# Altium schematic sheet PCB_DYBoard_Collector_V1_Sh1.SchDoc
size A4; SheetNumber: 1; SheetTotal: 3
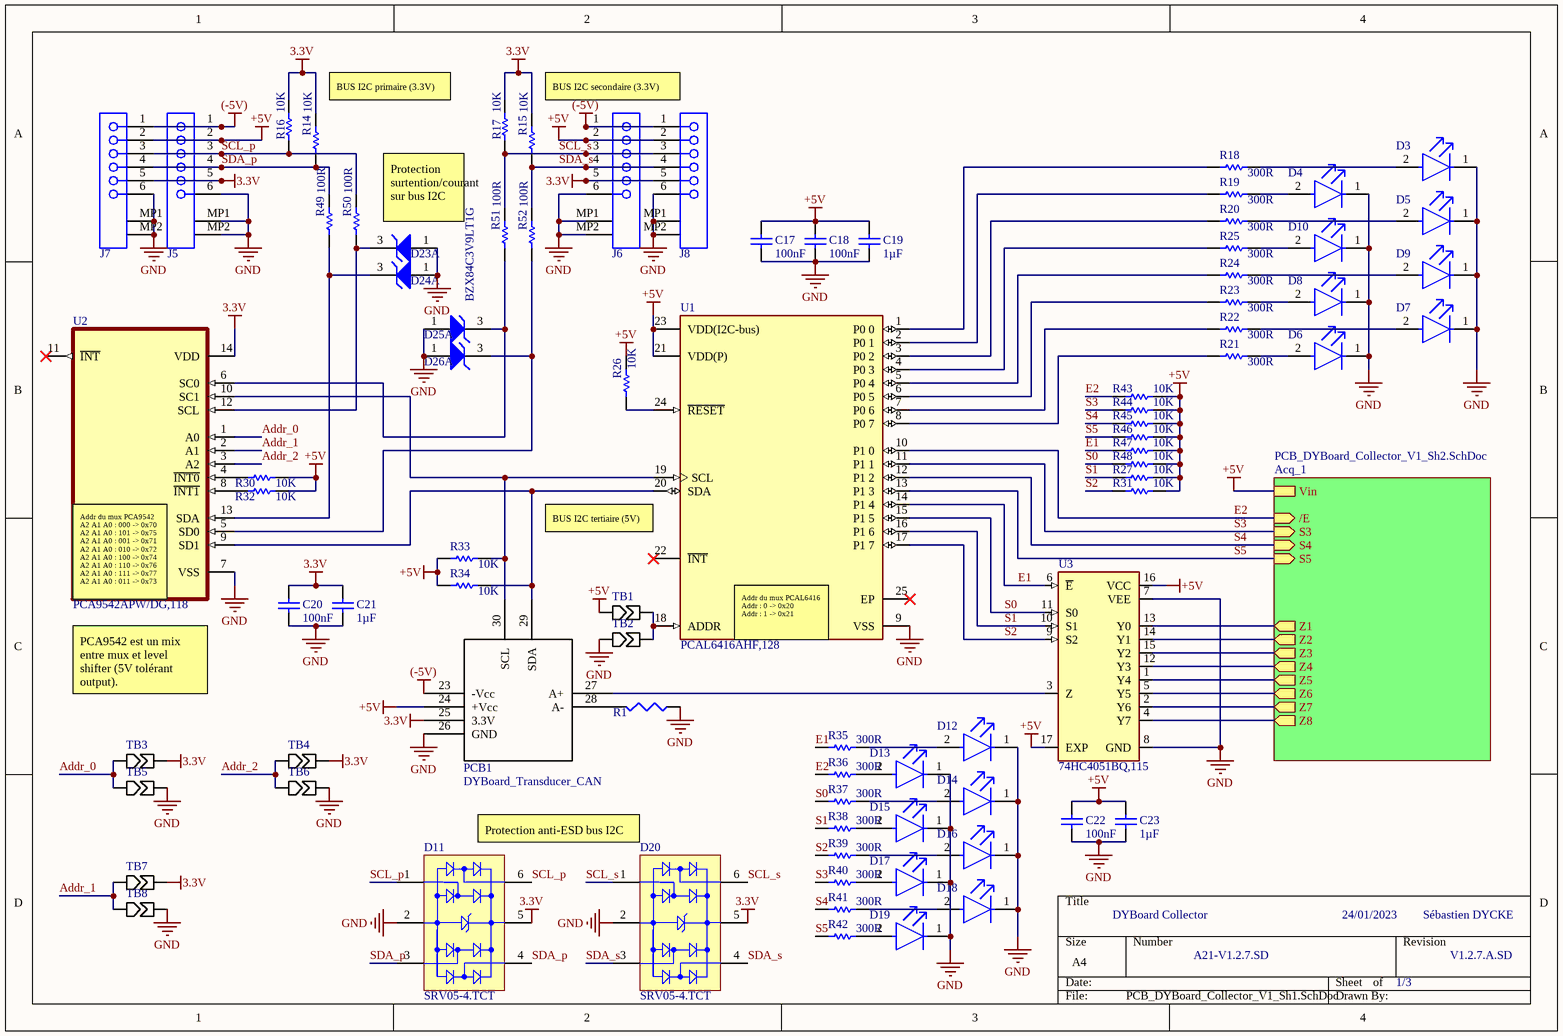
[diagram p0: PCB_DYBoard_Collector_V1_Sh1.SchDoc]

## Parts
C17  value 100nF  [1608[0603]]  (hidden comment: Cap Semi)
C18  value 100nF  [1608[0603]]  (hidden comment: Cap Semi)
C19  value 1µF  [1608[0603]]  (hidden comment: Cap Semi)
C20  value 100nF  [1608[0603]]  (hidden comment: Cap Semi)
C21  value 1µF  [1608[0603]]  (hidden comment: Cap Semi)
C22  value 100nF  [1608[0603]]  (hidden comment: Cap Semi)
C23  value 1µF  [1608[0603]]  (hidden comment: Cap Semi)
D3  LTST-C191TBKT  [FP-LTST-C191TBKT-MFG]  (value not drawn)
D4  LTST-C191TBKT  [FP-LTST-C191TBKT-MFG]  (value not drawn)
D5  LTST-C191TBKT  [FP-LTST-C191TBKT-MFG]  (value not drawn)
D6  LTST-C191TBKT  [FP-LTST-C191TBKT-MFG]  (value not drawn)
D7  LTST-C191TBKT  [FP-LTST-C191TBKT-MFG]  (value not drawn)
D8  LTST-C191TBKT  [FP-LTST-C191TBKT-MFG]  (value not drawn)
D9  LTST-C191TBKT  [FP-LTST-C191TBKT-MFG]  (value not drawn)
D10  LTST-C191TBKT  [FP-LTST-C191TBKT-MFG]  (value not drawn)
D11  SRV05-4.TCT  [SMTC-SOT23-6_V]
D12  LTST-C191TBKT  [FP-LTST-C191TBKT-MFG]  (value not drawn)
D13  LTST-C191TBKT  [FP-LTST-C191TBKT-MFG]  (value not drawn)
D14  LTST-C191TBKT  [FP-LTST-C191TBKT-MFG]  (value not drawn)
D15  LTST-C191TBKT  [FP-LTST-C191TBKT-MFG]  (value not drawn)
D16  LTST-C191TBKT  [FP-LTST-C191TBKT-MFG]  (value not drawn)
D17  LTST-C191TBKT  [FP-LTST-C191TBKT-MFG]  (value not drawn)
D18  LTST-C191TBKT  [FP-LTST-C191TBKT-MFG]  (value not drawn)
D19  LTST-C191TBKT  [FP-LTST-C191TBKT-MFG]  (value not drawn)
D20  SRV05-4.TCT  [SMTC-SOT23-6_V]
D23  BZX84C3V9LT1G  [ONSC-SOT-23-3-318-08_V]  (part A of 2)
D24  BZX84C3V9LT1G  [ONSC-SOT-23-3-318-08_V]  (value not drawn)  (part A of 2)
D25  BZX84C3V9LT1G  [ONSC-SOT-23-3-318-08_V]  (value not drawn)  (part A of 2)
D26  BZX84C3V9LT1G  [ONSC-SOT-23-3-318-08_V]  (value not drawn)  (part A of 2)
J5  SEB_MOLeX_6p  [SEB_MOLeX_6p]  (value not drawn)
J6  SEB_MOLeX_6p  [SEB_MOLeX_6p]  (value not drawn)
J7  SEB_MOLeX_6p  [SEB_MOLeX_6p]  (value not drawn)
J8  SEB_MOLeX_6p  [SEB_MOLeX_6p]  (value not drawn)
PCB1  DYBoard_Transducer_CAN  [DYBoard_Transducer_CAN]
R1  Res3  [J1-0603]  (value not drawn)
R14  10K  [RESC1609X60X30LL10T20]
R15  10K  [RESC1609X60X30LL10T20]
R16  10K  [RESC1609X60X30LL10T20]
R17  10K  [RESC1609X60X30LL10T20]
R18  300R  [RESC1609X60X30LL10T20]
R19  300R  [RESC1609X60X30LL10T20]
R20  300R  [RESC1609X60X30LL10T20]
R21  300R  [RESC1609X60X30LL10T20]
R22  300R  [RESC1609X60X30LL10T20]
R23  300R  [RESC1609X60X30LL10T20]
R24  300R  [RESC1609X60X30LL10T20]
R25  300R  [RESC1609X60X30LL10T20]
R26  10K  [RESC1609X60X30LL10T20]
R27  10K  [RESC1609X60X30LL10T20]
R30  10K  [RESC1609X60X30LL10T20]
R31  10K  [RESC1609X60X30LL10T20]
R32  10K  [RESC1609X60X30LL10T20]
R33  10K  [RESC1609X60X30LL10T20]
R34  10K  [RESC1609X60X30LL10T20]
R35  300R  [RESC1609X60X30LL10T20]
R36  300R  [RESC1609X60X30LL10T20]
R37  300R  [RESC1609X60X30LL10T20]
R38  300R  [RESC1609X60X30LL10T20]
R39  300R  [RESC1609X60X30LL10T20]
R40  300R  [RESC1609X60X30LL10T20]
R41  300R  [RESC1609X60X30LL10T20]
R42  300R  [RESC1609X60X30LL10T20]
R43  10K  [RESC1609X60X30LL10T20]
R44  10K  [RESC1609X60X30LL10T20]
R45  10K  [RESC1609X60X30LL10T20]
R46  10K  [RESC1609X60X30LL10T20]
R47  10K  [RESC1609X60X30LL10T20]
R48  10K  [RESC1609X60X30LL10T20]
R49  100R  [RESC1609X60X30LL10T20]
R50  100R  [RESC1609X60X30LL10T20]
R51  100R  [RESC1609X60X30LL10T20]
R52  100R  [RESC1609X60X30LL10T20]
TB1  tin_bridge  [tin_bridge]  (value not drawn)
TB2  tin_bridge  [tin_bridge]  (value not drawn)
TB3  tin_bridge  [tin_bridge]  (value not drawn)
TB4  tin_bridge  [tin_bridge]  (value not drawn)
TB5  tin_bridge  [tin_bridge]  (value not drawn)
TB6  tin_bridge  [tin_bridge]  (value not drawn)
TB7  tin_bridge  [tin_bridge]  (value not drawn)
TB8  tin_bridge  [tin_bridge]  (value not drawn)
U1  PCAL6416AHF,128  [FP-SOT994-1-MFG]
U2  PCA9542APW/DG,118  [SOP65P640X110-14N]
U3  74HC4051BQ,115  [QFN50P250X350X100-17N]

## Sub-sheets
Acq_1 = PCB_DYBoard_Collector_V1_Sh2.SchDoc: Vin, Z1 (out), S3 (in), S4 (in), S5 (in), /E (in), Z2 (out), Z3 (out), Z4 (out), Z5 (out), Z6 (out), Z7 (out), Z8 (out)

## Nets
3.3V: C20.2 C21.2 D11.5(VBUS) D20.5(VBUS) J5.5 J6.5 J7.5 J8.5 PCB1.25(3.3V) R14.2 R15.2 R16.2 R17.2 TB3.22 TB4.22 TB7.22 U2.14(VDD)
(-5V): J5.1 J6.1 J7.1 J8.1 PCB1.23(-Vcc)
+5V: C17.2 C18.2 C19.2 C22.2 C23.2 J5.2 J6.2 J7.2 J8.2 PCB1.24(+Vcc) R26.2 R27.1 R30.1 R31.1 R32.1 R33.2 R34.2 R43.1 R44.1 R45.1 R46.1 R47.1 R48.1 TB1.21 U1.21(VDD(P)) U1.23(VDD(I2C-bus)) U3.16(VCC) U3.17(EXP) ; sheet Acq_1/Vin
GND: C17.1 C18.1 C19.1 C20.1 C21.1 C22.1 C23.1 D3.1(C) D4.1(C) D5.1(C) D6.1(C) D7.1(C) D8.1(C) D9.1(C) D10.1(C) D11.2(GND) D12.1(C) D13.1(C) D14.1(C) D15.1(C) D16.1(C) D17.1(C) D18.1(C) D19.1(C) D20.2(GND) D23.1(A) D24.1(A) D25.1(A) D26.1(A) J5.6 J5.MP1 J5.MP2 J6.6 J6.MP1 J6.MP2 J7.6 J7.MP1 J7.MP2 J8.6 J8.MP1 J8.MP2 PCB1.26(GND) R1.2 TB2.21 TB5.22 TB6.22 TB8.22 U1.9(VSS) U2.7(VSS) U3.7(VEE) U3.8(GND)
Addr_0: TB3.21 TB5.21 U2.1(A0)
Addr_1: TB7.21 TB8.21 U2.2(A1)
Addr_2: TB4.21 TB6.21 U2.3(A2)
E1: R35.1 R47.2 U1.14(P1_4) U3.6(~{E})
E2: R36.1 R43.2 U1.10(P1_0) ; sheet Acq_1//E
S0: R37.1 R48.2 U1.15(P1_5) U3.11(S0)
S1: R27.2 R38.1 U1.16(P1_6) U3.10(S1)
S2: R31.2 R39.1 U1.17(P1_7) U3.9(S2)
S3: R40.1 R44.2 U1.11(P1_1) ; sheet Acq_1/S3
S4: R41.1 R45.2 U1.12(P1_2) ; sheet Acq_1/S4
S5: R42.1 R46.2 U1.13(P1_3) ; sheet Acq_1/S5
SCL_p: D11.1(I/O_1) D11.6(I/O_4) J5.3 J7.3 R16.1 R50.2
SCL_s: D20.1(I/O_1) D20.6(I/O_4) J6.3 J8.3 R17.1 R51.2
SDA_p: D11.3(I/O_2) D11.4(I/O_3) J5.4 J7.4 R14.1 R49.2
SDA_s: D20.3(I/O_2) D20.4(I/O_3) J6.4 J8.4 R15.1 R52.2
NetD3_2: D3.2(A) R18.2
NetD4_2: D4.2(A) R19.2
NetD5_2: D5.2(A) R20.2
NetD6_2: D6.2(A) R21.2
NetD7_2: D7.2(A) R22.2
NetD8_2: D8.2(A) R23.2
NetD9_2: D9.2(A) R24.2
NetD10_2: D10.2(A) R25.2
NetD12_2: D12.2(A) R35.2
NetD13_2: D13.2(A) R36.2
NetD14_2: D14.2(A) R37.2
NetD15_2: D15.2(A) R38.2
NetD16_2: D16.2(A) R39.2
NetD17_2: D17.2(A) R40.2
NetD18_2: D18.2(A) R41.2
NetD19_2: D19.2(A) R42.2
NetD23_3: D23.3(K) R50.1 U2.12(SCL)
NetD24_3: D24.3(K) R49.1 U2.13(SDA)
NetD25_3: D25.3(K) R51.1 U2.6(SC0)
NetD26_3: D26.3(K) R52.1 U2.5(SD0)
NetPCB1_27: PCB1.27(A+) U3.3(Z)
NetPCB1_28: PCB1.28(A-) R1.1
NetPCB1_29: PCB1.29(SDA) R34.1 U1.20(SDA) U2.9(SD1)
NetPCB1_30: PCB1.30(SCL) R33.1 U1.19(SCL) U2.10(SC1)
NetR18_1: R18.1 U1.1(P0_0)
NetR19_1: R19.1 U1.2(P0_1)
NetR20_1: R20.1 U1.3(P0_2)
NetR21_1: R21.1 U1.8(P0_7)
NetR22_1: R22.1 U1.7(P0_6)
NetR23_1: R23.1 U1.6(P0_5)
NetR24_1: R24.1 U1.5(P0_4)
NetR25_1: R25.1 U1.4(P0_3)
NetR26_1: R26.1 U1.24(~{RESET})
NetR30_2: R30.2 U2.4(~{INT0})
NetR32_2: R32.2 U2.8(~{INT1})
NetTB1_22: TB1.22 TB2.22 U1.18(ADDR)
NetU3_1: U3.1(Y4) ; sheet Acq_1/Z5
NetU3_2: U3.2(Y6) ; sheet Acq_1/Z7
NetU3_4: U3.4(Y7) ; sheet Acq_1/Z8
NetU3_5: U3.5(Y5) ; sheet Acq_1/Z6
NetU3_12: U3.12(Y3) ; sheet Acq_1/Z4
NetU3_13: U3.13(Y0) ; sheet Acq_1/Z1
NetU3_14: U3.14(Y1) ; sheet Acq_1/Z2
NetU3_15: U3.15(Y2) ; sheet Acq_1/Z3

Not connected (* = marked no-connect by the designer): U1 22(~{INT})* 25(EP)*; U2 11(~{INT})*

## Notes on the sheet
- BUS I2C primaire (3.3V)
- BUS I2C secondaire (3.3V)
- Protection surtention/courant sur bus I2C
- (near U1) BUS I2C tertiaire (5V)
- (near U2) Addr du mux PCA9542  A2 A1 A0 : 000 -> 0x70  A2 A1 A0 : 101 -> 0x75  A2 A1 A0 : 001 -> 0x71  A2 A1 A0 : 010 -> 0x72  A2 A1 A0 : 100 -> 0x74  A2 A1 A0 : 110 -> 0x76  A2 A1 A0 : 111 -> 0x77  A2 A1 A0 : 011 -> 0x73
- (near U1) Addr du mux PCAL6416  Addr : 0 -> 0x20                 Addr : 1 -> 0x21
- PCA9542 est un mix entre mux et level shifter (5V tolérant output).
- Protection anti-ESD bus I2C
- DYBoard Collector
- 24/01/2023
- Sébastien DYCKE
- A21-V1.2.7.SD
- 1/3
- V1.2.7.A.SD

## Library data of the parts
C17-C23 = Cap Semi: Capacitor (Semiconductor SIM Model); Published: 8-Jun-2000; LatestRevisionDate: 29-May-2009; LatestRevisionNote: IPC-7351 Footprint Added.; PackageReference: C1206; Publisher: Altium Limited; PackageDescription: Chip Capacitor
D3-D10 D12-D19 = CMP-22017-000008-1: LED BLUE CLEAR CHIP SMD; Lens Color: Colorless; Dominant Wavelength: 475nm; Forward Current: 20mA; Wavelength: 468nm; Viewing Angle: 130°; Power Dissipation: 76mW; Luminous Intensity: 180mcd; Reverse Voltage: 5V; Number of Elements: 1; Lens Style: Diffused; Forward Voltage: 3.8V; Max Power Dissipation: 75mW; Case Code (Metric): 1608; Packaging: Tape and Reel; Case/Package: 0603; Depth: 1.6mm; Mount: Surface Mount; Lead Free: Lead Free; Min Operating Temperature: -20°C; Lens Transparency: Clear; Illumination Color: Blue; Height: 0.55mm; Test Current: 20mA; Case Code (Imperial): 0603; Max Operating Temperature: 80°C; Number of Pins: 2; Length: 0.8mm; Radiation Hardening: No; Package Quantity: 1; Number of LEDs: 1; Width: 0.8mm; Color: Blue
D11 D20 = CMP-2000-05358-1: RailClamp(R) Low Capacitance TVS Diode Array, 5 pF, 17.5 VC, -55 to 125 degC, 6-Pin SOT23, RoHS, Tape and Reel; Manufacturer: Semtech; Leakage Current (Max): 5uA; Polarity: Uni-Directional; Peak Pulse Power Dissipation: 300W; Clamping Voltage: 17.5V; Number of Elements: 1; Working Voltage: 5V; Test Current (It): 1mA; Configuration: Quad; Reverse Breakdown Voltage: 6V; Suppressor Type: DiodeArrays; Peak Pulse Current: 12A; Product Depth (mm): 1.6mm; Product Height (mm): 1.15mm; Clamping Voltage (Max): 12.5V; Rad Hardened: No; Product Length (mm): 2.9mm; Capacitance Value: 5pF; Mounting: SurfaceMount; Datasheet URL: https://datasheet.ciiva.com/8029/srv05-4-8029973.pdf; Datasheet Version: Jan-08; Packaging: TapeandReel; Package / Case: SOT-23; Operating Temp Range: -55Cto125C; Pin Count: 6; Direction Type: Uni-Directional; Operating Temperature Min Deg. C: -55C; Reverse Stand-off Voltage: 5V; Leakage Current: 5uA; Manufacturer URL: http://www.semtech.com/; Working Voltage (Max): 5V; Package Reference: SOT23-6; Package Description: 6-Pin Small Outline Transistor, Body 2.9 x 1.6 mm, Pitch 0.95 mm; Operating Temperature Max Deg. C: 125C; Operating Temperature Classification: Military; Mounting Style: SurfaceMount
D23-D26 = CMP-1060-01129-1: Zener Voltage Regulator, 225 mW, 3-Pin SOT-23, Pb-Free, Tape and Reel; Manufacturer: On Semiconductor; ComponentLink3URL: http://www.onsemi.cn/pub_link/Collateral/318-08.PDF; PartNumber: BZX84C3V9LT1G; ComponentLink2URL: http://www.onsemi.com/pub_link/Collateral/BZX84C2V4LT1-D.PDF; PackageReference: SOT-23-3-318-08; DatasheetVersion: Rev. 17; ComponentLink3Description: Package Specification; ComponentLink1Description: Manufacturer URL; Packing: Tape and Reel; ComponentLink1URL: http://www.onsemi.com/; RoHS: Pb-Free; PackageVersion: Rev. AP, 11/2009; Mounting Technology: Surface Mount; PackageDescription: 3-Pin Small Outline Transistor, Body 2.92 x 1.3 mm, Pitch 0.95 mm; ComponentLink2Description: Datasheet
R1 = Res3: Resistor; Published: 8-Jun-2000; LatestRevisionDate: 29-May-2009; LatestRevisionNote: IPC-7351 Footprint Added.; PackageReference: J1-0603; Publisher: Altium Limited; PackageDescription: Chip Resistor
R14-R27 R30-R52 = CMP-2000-03671-1: Part Number: RCWE0603R560FKEA; Manufacturer: Vishay Dale
U1 = CMP-10112-000009-1: IC I/O EXPANDER 16BIT 24HWQFN; Manufacturer: NXP Semiconductors; Number Of I/Os: 16; Min Supply Voltage: 1.65V; Frequency: 400kHz; Standoff Height: 0mm; Max Junction Temp: +125°C; Max Supply Voltage: 5.5V; Nominal Supply Current: 1.1mA; Interface: I2C,SMBus; Digikey Description: IC I/O EXPANDER 16BIT 24HWQFN; Device Class L3: I/O Expanders; Automotive: No; Mouser Description: Interface - I/O Expanders 16-bit I2C-busSMBus Low Voltage; Ambient Temperature Range Low: -40°C; Category: IC; ComponentLink2URL: https://www.nxp.com/docs/en/data-sheet/PCAL6416A.pdf; Ambient Temperature Range High: +85°C; Height: 0.8mm; Device Class L1: Integrated Circuits (ICs); Package: SOT994-1; RoHS: TRUE; Temperature Range High: +85°C; Octopart: https://octopart.com/pcal6416ahf%2C128-nxp+semiconductors-24406122; Lead Free: Yes; ComponentLink2Description: Datasheet; Device Class L2: Interface ICs; Temperature Range Low: -40°C; Manufacturer Part Number: PCAL6416AHF,128; Temperature: -40°C to +85°C; Ipc Land Pattern Name: QFN50P400X400X80-24; Footprint Url: https://www.nxp.com/docs/en/package-information/SOT994-1.pdf
U2 = PCA9542APW/DG,118: 2-channel I2C-bus multiplexer and interrupt logic; Package: None; Price: None; Value: *; MP: PCA9542APW/DG,118; Availability: Unavailable
U3 = 74HC4051BQ,115: 1 Circuit IC Switch 8:1 120Ohm 16-DHVQFN _2.5x3.5_; MF: Nexperia USA; Value: *; SnapEDA_Link: https://www.snapeda.com/parts/74HC4051BQ%2C115/Nexperia%20USA%20Inc./view-part/523294/?ref=snap; Availability: Unavailable; MP: 74HC4051BQ,115; Package: DHVQFN-16 NXP Semiconductors; Price: None